# EAGLE design POWER_SUPPLY_BOARD (EAGLE 9.6.2)
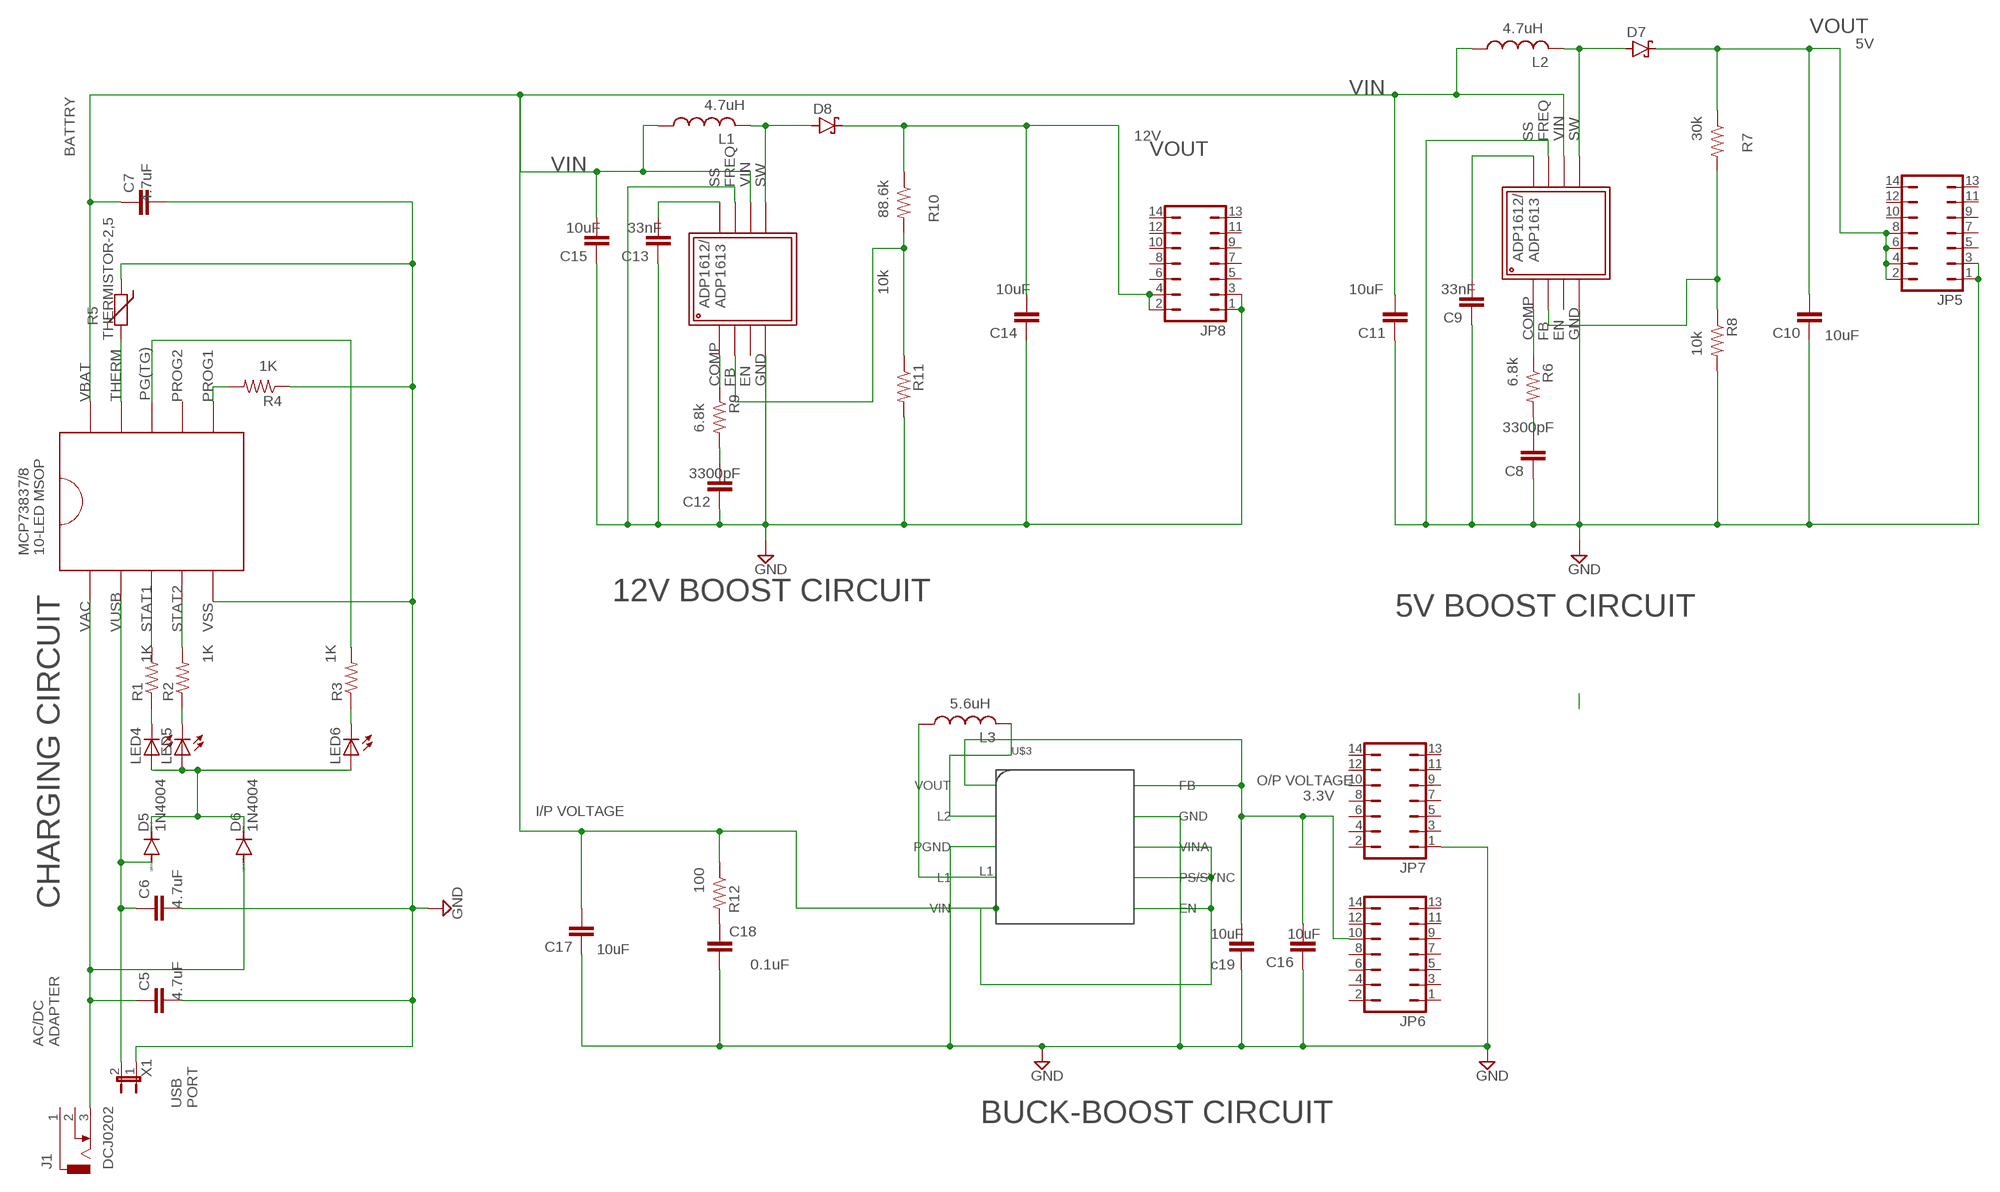
[diagram p0: schematic, sheet 1]

## Parts
C1  C2,5-3  [C2.5-3]
C5  C2.5/5  [C2.5-5]
C6  C2.5/5  [C2.5-5]
C7  C2.5/5  [C2.5-5]
C8  C2,5-3  [C2.5-3]
C9  C2,5-3  [C2.5-3]
C10  C2,5-3  [C2.5-3]
C11  C2,5-3  [C2.5-3]
C12  C2,5-3  [C2.5-3]
C13  C2,5-3  [C2.5-3]
C14  C2,5-3  [C2.5-3]
C15  C2,5-3  [C2.5-3]
C16  C2,5-3  [C2.5-3]
C17  C2,5-3  [C2.5-3]
C18  C2,5-3  [C2.5-3]
D5  1N4004  [DO41-10]
D6  1N4004  [DO41-10]
D7  SCHOTTKY-DIODEC4111-15  [C4111-15]
D8  SCHOTTKY-DIODEC4111-15  [C4111-15]
J1  DCJ0202  [DCJ0202]
JP1  JP1E  [JP1]
JP5  JP7Q  [JP7Q]
JP6  JP7Q  [JP7Q]
JP7  JP7Q  [JP7Q]
JP8  JP7Q  [JP7Q]
L1  L-US0204/5  [0204/5]
L2  L-US0204/5  [0204/5]
L3  L-US0204/5  [0204/5]
LED4  LED3MM  [LED3MM]
LED5  LED3MM  [LED3MM]
LED6  LED3MM  [LED3MM]
R1  R-US_0204/2V  [0204V]
R2  R-US_0204/2V  [0204V]
R3  R-US_0204/2V  [0204V]
R4  R-US_0204/2V  [0204V]
R5  THERMISTOR-2,5  [RS-2,5]
R6  R-US_0204/2V  [0204V]
R7  R-US_0204/2V  [0204V]
R8  R-US_0204/2V  [0204V]
R9  R-US_0204/2V  [0204V]
R10  R-US_0204/2V  [0204V]
R11  R-US_0204/2V  [0204V]
R12  R-US_0204/2V  [0204V]
U$1  ADP1612  [ADP1612]
U$2  ADP1612  [ADP1612]
U$3  TPS63002  [TPS63002]
U$4  MCP73837/8  [MCP73837/8]

## Nets
GND: C1.1 C5.2 C6.2 C7.2 C8.1 C9.1 C10.1 C11.1 C12.1 C13.1 C14.1 C15.1 C16.1 C17.1 C18.2 JP1.1 JP5.1 JP5.3 JP7.1 JP8.1 JP8.3 R4.1 R5.1 R8.2 R11.2 U$1.P$4 U$1.P$6 U$2.P$4 U$2.P$6 U$3.GND U$3.PGND U$4.P$5
N$1: C10.2 D7.C JP5.2 JP5.4 JP5.6 JP5.8 R7.1
N$2: L3.1 U$3.L1
N$3: C7.1 C11.2 C15.2 C17.2 L1.1 L2.1 R12.1 U$1.P$7 U$2.P$7 U$3.EN U$3.PS/SYNC U$3.VIN U$3.VINA U$4.P$10
N$4: C1.2 C16.2 JP6.10 U$3.FB U$3.VOUT
N$5: L3.2 U$3.L2
N$6: C18.1 R12.2
N$7: C5.1 D6.A J1.3 U$4.P$1
N$9: C14.2 D8.C JP8.2 JP8.4 R10.1
N$11: C6.1 D5.A JP1.2 U$4.P$2
N$12: D5.C D6.C LED4.A LED5.A LED6.A
N$13: R4.2 U$4.P$6
N$14: R5.2 U$4.P$9
N$15: LED4.K(C) R1.1
N$16: R1.2 U$4.P$3
N$17: R2.2 U$4.P$4
N$18: LED5.K(C) R2.1
N$19: LED6.K(C) R3.1
N$20: R3.2 U$4.P$8
N$24: D7.A L2.2 U$1.P$8
N$25: R6.1 U$1.P$1
N$26: C8.2 R6.2
N$27: R7.2 R8.1 U$1.P$2
N$28: C9.2 U$1.P$5
N$30: D8.A L1.2 U$2.P$8
N$32: R9.1 U$2.P$1
N$33: C12.2 R9.2
N$34: R10.2 R11.1 U$2.P$2
N$35: C13.2 U$2.P$5
Unconnected: J1.1 J1.2 JP5.5 JP5.7 JP5.9 JP5.10 JP5.11 JP5.12 JP5.13 JP5.14 JP6.1 JP6.2 JP6.3 JP6.4 JP6.5 JP6.6 JP6.7 JP6.8 JP6.9 JP6.11 JP6.12 JP6.13 JP6.14 JP7.2 JP7.3 JP7.4 JP7.5 JP7.6 JP7.7 JP7.8 JP7.9 JP7.10 JP7.11 JP7.12 JP7.13 JP7.14 JP8.5 JP8.6 JP8.7 JP8.8 JP8.9 JP8.10 JP8.11 JP8.12 JP8.13 JP8.14 U$1.P$3 U$2.P$3 U$4.P$7

## Notes on the sheet
- 4.7uH | VOUT
- 5V
- VIN
- 4.7uH
- 12V | 30k
- BATTRY | VOUT
- VIN
- 4.7uF
- 88.6k
- 10uF | 33nF
- 10k | 10uF | 10uF | 33nF
- 10uF
- 10k
- 1K
- 6.8k
- 6.8k | 3300pF
- 3300pF
- 12V BOOST CIRCUIT
- 5V BOOST CIRCUIT
- 1K | 1K | 1K
- 5.6uH
- O/P VOLTAGE
- 3.3V
- I/P VOLTAGE
- 100
- CHARGING CIRCUIT | 4.7uF
- 10uF | 10uF
- 10uF
- 0.1uF | c19
- 4.7uF
- AC/DC
  ADAPTER
- X1
- USB
  PORT
- BUCK-BOOST CIRCUIT

## Library data of the parts
C1 C5-C18 = capacitor-wima:C: CAPACITOR naming: grid - package width
D5 D6 = diode:1N4004: DIODE general purpose rectifier, 1 A
D7 D8 = diode:SCHOTTKY-DIODE: Schottky Diode
J1 = con-jack:DCJ0202: DC POWER JACK Source: DCJ0202.pdf; OC_FARNELL: unknown; OC_NEWARK: unknown
JP1 = jumper:JP1E: JUMPER
JP5-JP8 = jumper:JP7Q: JUMPER
L1-L3 = rcl:L-US: INDUCTOR, American symbol; SPICEPREFIX: L
LED4-LED6 = adafruit:LED: LED OSRAM: - CHIPLED LG R971, LG N971, LY N971, LG Q971, LY Q971, LO R971, LY R971 LH N974, LH R974 LS Q976, LO Q976, LY Q976 LO Q996 - Hyper CHIPLED LW Q18S LB Q993, LB Q99A, LB R99A - SideLED LS A670, LO A670, LY A670, LG A670, LP A670 LB A673, LV A673, LT A673, LW A673 LH A674 LY A675 LS A676, LA A676, LO A676, LY A676, LW A676 LS A679, LY A679, LG A679 - Hyper Micro SIDELED® LS Y876, LA Y876, LO Y876, LY Y876 LT Y87S - SmartLED LW L88C, LW L88S LB L89C, LB L89S, LG L890 LS L89K, LO L89K, LY L89K LS L896, LA L896, LO L896, LY L896 - TOPLED LS T670, LO T670, LY T670, LG T670, LP T670 LSG T670, LSP T670, LSY T670, LOP T670, LYG T670 LG T671, LOG T671, LSG T671 LB T673, LV T673, LT T673, LW T673 LH T674 LS T676, LA T676, LO T676, LY T676, LB T676, LH T676, LSB T676, LW T676 LB T67C, LV T67C, LT T67C, LS T67K, LO T67K, LY T67K, LW E67C LS E67B, LA E67B, LO E67B, LY E67B, LB E67C, LV E67C, LT E67C LW T67C LS T679, LY T679, LG T679 LS T770, LO T770, LY T770, LG T770, LP T770 LB T773, LV T773, LT T773, LW T773 LH T774 LS E675, LA E675, LY E675, LS T675 LS T776, LA T776, LO T776, LY T776, LB T776 LHGB T686 LT T68C, LB T68C - Hyper Mini TOPLED® LB M676 - Mini TOPLED Santana® LG M470 LS M47K, LO M47K, LY M47K Source: http://www.osram.convergy.de/
R1-R4 R6-R12 = rcl:R-US_: RESISTOR, American symbol; SPICEPREFIX: R
R5 = varistor:THERMISTOR: THERMISTOR
U$1 U$2 = ADP1612:ADP1612
U$3 = TPS63002:TPS63002
U$4 = MCP73837:MCP73837/8

## Board
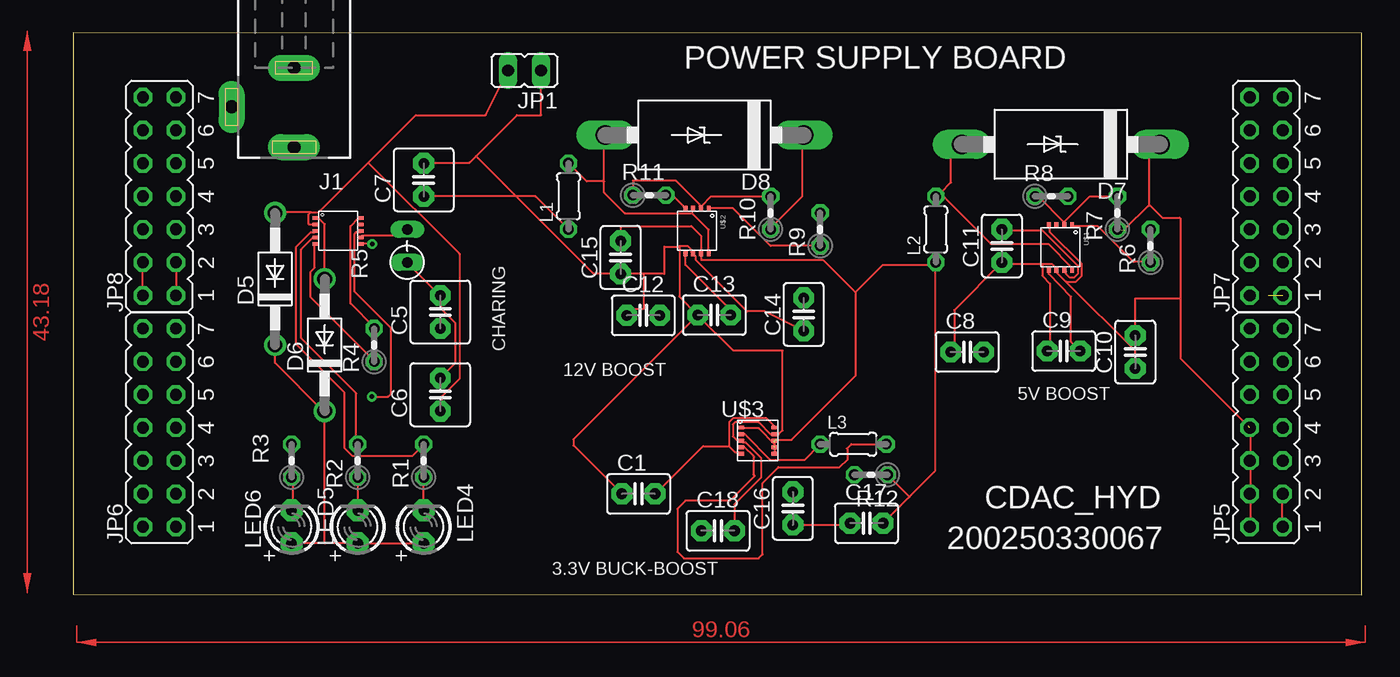
[diagram p1: board, top side]
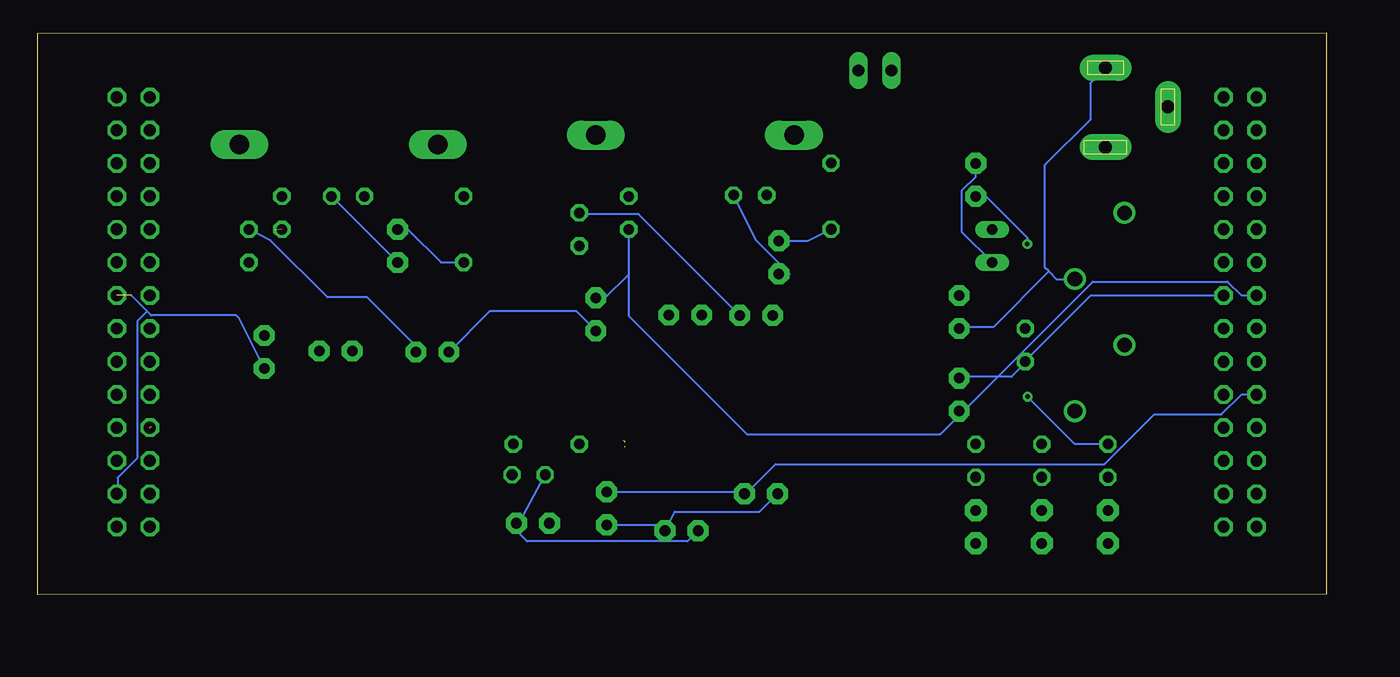
[diagram p2: board, bottom side, seen from below]

Size 99.06 x 43.22 mm. Coordinates in mm from the lower left corner, seen from the top.
Outline: 0,0.05 99.06,0 99.06,43.17 0,43.22 0,0.05
Copper layers (1*16): Top 0.035mm / dielectric 1.5mm / Bottom 0.035mm
Design rules "default": minimum track width 6mil, minimum drill 0.35mm, track to track 6mil, track to pad 6mil, pad to pad 6mil, via to via 6mil, smd to smd 6mil, copper to edge 40mil, drill to drill 6mil, minimum pad ring 10mil, minimum via ring 8mil, stop-mask expansion 4mil, vias tented up to drill 0mil, thermal gap 10mil

### Footprints (pad centres in the part's own frame; a part is rotated, then mirrored left to right if it is on the bottom)
C2.5-3 = drill 0.813 pad 1.6 octagon: 1 -1.27,0; 2 1.27,0
C2.5-5 = drill 0.813 pad 1.6 octagon: 1 -1.27,0; 2 1.27,0
DO41-10 = drill 1.118: A 5.08,0; C -5.08,0
C4111-15 = drill 1.499 long: A 7.62,0; C -7.62,0
DCJ0202 = drill 1 pad 2 long: 1 0,3.1; 2 4.8,0; 3 0,-3
JP1 = drill 0.914 long: 1 0,-1.27; 2 0,1.27
JP7Q = drill 0.914 octagon: 1 -7.62,-1.27; 2 -7.62,1.27; 3 -5.08,-1.27; 4 -5.08,1.27; 5 -2.54,-1.27; 6 -2.54,1.27; 7 0,-1.27; 8 0,1.27; 9 2.54,-1.27; 10 2.54,1.27; 11 5.08,-1.27; 12 5.08,1.27; 13 7.62,-1.27; 14 7.62,1.27
0204/5 = drill 0.813 octagon: 1 -2.54,0; 2 2.54,0
LED3MM = drill 0.813 pad 1.676 octagon: A -1.27,0; K 1.27,0
0204V = drill 0.813 octagon: 1 -1.27,0; 2 1.27,0
RS-2,5 = drill 0.813 long: 1 -1.27,0; 2 1.27,0
ADP1612 = smd 0.4 x 0.3: P$1 -9.25,5.4; P$2 -9.25,4.8; P$3 -9.25,4.2; P$4 -9.25,3.6; P$5 -5.75,3.6; P$6 -5.75,4.2; P$7 -5.75,4.8; P$8 -5.75,5.4
TPS63002 = smd 0.5 x 0.3: EN 2.85,0.55; FB 2.85,2.55; GND 2.85,2.05; L1 0.25,2.05; L2 0.25,1.05; PGND 0.25,1.55; PS/SYNC 2.85,1.05; VIN 0.25,2.55; VINA 2.85,1.55; VOUT 0.25,0.55
MCP73837/8 = smd 0.4 x 0.25: P$1 -3.25,8.5; P$2 -3.25,8; P$3 -3.25,7.5; P$4 -3.25,7; P$5 -3.25,6.5; P$6 0.25,8.5; P$7 0.25,8; P$8 0.25,7.5; P$9 0.25,7; P$10 0.25,6.5

### Placement (x,y rotation side)
C1  43.45,7.77 0 top
C5  28.21,21.74 90 top
C6  28.21,15.39 90 top
C7  26.95,31.9 90 top
C8  68.72,18.67 0 top
C9  76.15,18.74 0 top
C10  81.65,18.67 90 top
C11  71.4,26.82 90 top
C12  43.83,21.49 0 top
C13  49.28,21.51 0 top
C14  56.16,21.56 90 top
C15  42.08,25.94 90 top
C16  55.32,6.65 90 top
C17  60.99,5.5 0 top
C18  49.56,4.93 0 top
D5  15.52,24.28 90 top
D6  19.32,19.2 90 top
D7  75.93,34.63 180 top
D8  48.53,35.33 180 top
J1  16.98,37.51 180 top
JP1  34.69,40.31 90 top
JP5  91.72,12.85 90 top
JP6  6.62,12.85 90 top
JP7  91.72,30.63 90 top
JP8  6.62,30.63 90 top
L1  38.07,30.64 90 top
L2  66.31,28.09 90 top
L3  59.97,11.58 0 top
LED4  26.95,5.23 90 top
LED5  21.86,5.23 90 top
LED6  16.79,5.23 90 top
R1  26.95,10.31 90 top
R2  21.86,10.31 90 top
R3  16.79,10.31 90 top
R4  23.14,19.2 90 top
R5  25.68,26.82 90 top
R6  82.83,26.82 90 top
R7  80.28,29.36 90 top
R8  75.2,30.63 0 top
R9  57.42,28.09 90 top
R10  53.61,29.36 90 top
R11  44.29,30.72 0 top
R12  61.33,9.23 180 top
U$1  71.4,19.2 270 top
U$2  43.45,20.47 270 top
U$3  51.08,10.31 0 top
U$4  21.86,20.47 0 top

### Tracks (layer width: path | path; a pad name or v marks a point on that pad's centre or on a via)
GND  (1 unrouted)
  Top 0.152: 74.49,25.45 71.45,25.45 C11.1 67.73,21.88 67.73,18.8 C8.1 | 74.49,25.45 75.26,25.45 75.56,25.14 75.56,24.99 U$1.P$6 75.56,24.84 76.32,24.08 | 76.32,24.08 77.09,24.08 77.54,24.53 77.54,25.45 75.1,27.89 75.1,28.34 U$1.P$4 | 74.49,25.45 74.49,24.53 75.1,23.92 75.1,18.85 C9.1 | JP5.1 92.93,5.33 92.93,7.77 JP5.3 | C10.1 81.65,18.75 76.32,24.08 | 30.95,33.72 30.45,33.22 26.95,33.22 C7.2 | 30.95,33.72 34.11,36.88 35.97,36.88 JP1.1 | R5.1 25.73,25.45 28.16,23.01 C5.2 28.32,23.01 28.32,21.94 29.38,20.88 29.38,17.83 C6.2 | JP8.3 JP8.1 | U$4.P$5 18.56,26.97 18.56,25.14 18.26,24.84 18.26,22.86 23.14,17.98 R4.1 | R11.2 45.56,31.07 45.69,30.93 45.84,30.93 46.91,29.87 U$2.P$4 | 47.52,26.36 47.52,26.51 47.21,26.82 46.61,26.82 46.61,26.77 | 46.61,26.77 45.43,26.77 45.43,24.67 43.83,24.67 | 47.52,26.36 U$2.P$6 | 43.83,24.67 43.83,21.96 43.03,21.96 C12.1 | 43.83,24.67 C15.1 40.01,24.67 30.95,33.72 | 46.61,26.77 46.61,22.92 C13.1 | C14.1 53.15,21.79 51.8,21.79 47.88,25.72 47.88,26 47.52,26.36 | C13.1 50.75,18.77 54.53,18.77 54.53,12.65 54.22,12.34 54.07,12.34 U$3.GND 53.92,12.34 53.61,12.34 52.7,13.26 50.87,13.26 50.72,13.1 50.72,12.19 51.02,11.89 51.18,11.89 U$3.PGND | C16.1 55.32,5.33 59.55,5.33 C17.1 | 51.53,11.89 51.33,11.89 U$3.PGND | C1.1 38.46,11.5 38.46,11.96 C13.1 | U$3.PGND 51.45,11.74 51.67,11.74 52.86,10.54 52.86,8.98 50.83,6.96 C18.2
  Bottom 0.152: C11.1 R8.2 | 90.65,21.79 90.34,21.49 83.79,21.49 83.6,21.3 C10.1 | 90.65,21.79 91.87,23.01 | 90.65,21.79 91.41,21.03 91.41,10.51 92.93,8.99 92.93,7.77 JP5.3 | C6.2 28.16,16.76 24.2,16.76 23.14,17.83 R4.1 23.14,17.98 18.11,23.01 JP8.1 | C7.2 26.95,32.15 28.01,31.09 28.01,27.89 R5.1 | R11.2 43.81,27.23 41.25,24.67 C15.1 | 42.2,7.77 43.57,6.4 50.1,6.4 C18.2 51.24,5.33 55.32,5.33 C16.1 | C8.1 64.32,21.79 57.66,21.79 C14.1
N$1  (2 unrouted)
  Top 0.152: 90.5,7.77 90.5,5.33 JP5.2 | JP5.8 90.5,12.8 90.5,10.36 JP5.6 90.5,10.21 90.5,7.77 | 90.5,7.77 JP5.4 | 80.88,28.04 80.85,28.04 | 82.72,29.88 82.72,29.99 | 82.72,29.99 82.72,33.8 D7.C | 90.34,12.95 85.12,18.18 85.12,22.79 | 81.65,20.69 C10.2 81.65,22.77 81.67,22.79 85.12,22.79 | 85.12,22.79 85.12,28.93 85.06,28.99 83.72,28.99 82.72,29.99 | R7.1 80.83,28.09 82.72,29.99
N$2
  Top 0.152: L3.1 56.21,10.36 53.61,10.36 51.63,12.34 51.33,12.34 U$3.L1
N$3  (via drill 0.35)  (3 unrouted)
  Top 0.152: v22.98,26.97 22.22,26.97 U$4.P$10 | 48.28,25.75 48.28,26.21 U$2.P$7 | C15.2 42.08,28.33 47.53,28.33 48.27,27.59 48.27,25.75 48.28,25.75 | C7.1 35.54,30.63 L1.1 | R12.1 64.29,7.54 C17.2 66.26,9.51 66.26,25.45 L2.1 66.1,25.33 62.22,25.33 60.14,23.26 | U$1.P$7 76.32,24.84 76.32,24.69 76.63,24.38 76.93,24.38 77.24,24.69 77.24,25.3 74.49,28.04 71.45,28.04 C11.2 | 53.92,11.43 53.92,11.58 | 53.92,11.58 53.92,11.73 | 53.92,11.58 52.7,12.8 51.33,12.8 U$3.VIN | 55.24,11.89 55.17,11.89 | 55.17,11.89 54.07,11.89 | U$3.EN 53.92,10.97 53.92,11.27 U$3.PS/SYNC | 60.14,23.26 57.65,25.75 48.28,25.75 | 60.14,23.26 60.14,16.86 55.17,11.89 | 55.17,11.89
  Bottom 0.152: v22.98,26.97 22.98,27.43 26.18,30.63 C7.1 | C15.2 39.85,27.21 L1.1 | C11.2 71.29,28.04 70.56,28.04 68.07,25.55 L2.1
N$4
  Top 0.152: 50.42,11.43 50.87,10.97 51.18,10.97 U$3.VOUT | 50.42,11.43 50.42,13.26 50.72,13.56 53.31,13.56 53.92,12.95 U$3.FB | 50.42,11.43 48.43,11.43 44.78,7.77 C1.2
  Bottom 0.152: C16.2 44.88,7.92 C1.2 44.62,7.77 42.34,10.06 17.04,10.06 13.23,13.87 8.05,13.87 6.56,15.35 6.52,15.39 JP6.10
N$5
  Top 0.152: 52.35,10.61 52.28,10.68 | 52.28,10.68 51.6,11.36 U$3.L2 | 52.28,10.68 52.28,9.24 52.39,9.14 50.49,7.23 47.06,7.23 46.44,6.61 46.44,3.31 46.94,2.81 52.69,2.81 52.99,3.11 52.99,8.59 54.22,9.81 58.92,9.81 59.54,10.43 59.54,11.16 59.47,11.23 59.81,11.58 L3.2
N$6
  Bottom 0.152: R12.2 62.33,5 61.45,4.11 49.11,4.11 C18.1
N$7
  Top 0.152: D6.A 19.32,28.5 18.87,28.95 18.71,28.95 U$4.P$1
  Bottom 0.152: 21.32,24.85 25.6,20.57 28.16,20.57 C5.1 | D6.A 19.32,24.23 20.7,24.23 21.32,24.85 | J1.3 18.15,39.33 18.15,36.53 21.61,33.07 21.61,25.14 21.32,24.85
N$9
  Top 0.152: JP8.2 5.3,23.01 5.3,25.45 JP8.4 | D8.C 56.05,35.23 56.05,30.63 53.61,28.19 R10.1
  Bottom 0.152: R10.1 53.61,21.43 44.54,12.35 29.68,12.35 17.95,24.08 7.59,24.08 6.52,23.01 JP8.2 | C14.2 55.43,22.83 53.65,24.61
N$11
  Top 0.152: 18.26,29.41 15.57,29.41 D5.A | U$4.P$2 18.56,28.5 18.11,28.5 18.11,29.26 18.26,29.41 | 22.68,33.22 18.87,29.41 18.26,29.41 | 22.68,33.22 26.34,36.88 31.71,36.88 JP1.2 | 22.68,33.22 29.69,26.21 29.69,16.61 28.32,15.24 28.32,14.17 C6.1
N$12
  Top 0.152: D5.C 15.52,17.83 19.23,14.12 D6.C 19.32,3.96 | 19.32,3.96 LED5.A LED4.A | 19.32,3.96 LED6.A
N$13
  Top 0.152: U$4.P$6 22.07,28.95 21.92,28.95 21.31,28.34 21.31,22.4 23.14,20.57 R4.2
N$14
  Top 0.152: U$4.P$9 22.22,27.58 25.12,27.58 25.57,28.04 R5.2
N$15
  Top 0.152: LED4.K R1.1
N$16
  Top 0.152: R1.2 26.03,10.67 21.46,10.67 20.85,11.27 20.85,15.55 17.12,19.27 17.12,26.75 18.26,27.89 18.56,27.89 U$4.P$3
N$17
  Top 0.152: U$4.P$4 18.56,27.43 18.41,27.43 17.53,26.55 17.53,19.72 21.76,15.49 21.76,11.58 R2.2
N$18
  Top 0.152: R2.1 21.92,8.99 21.92,6.55 LED5.K
N$19
  Top 0.152: R3.1 16.89,8.99 16.89,6.55 LED6.K
N$20  (via drill 0.35)
  Top 0.152: v22.96,15.23 24.19,15.23 24.42,15.47 24.42,20.5 21.61,23.32 21.61,27.73 21.76,27.89 22.07,27.89 U$4.P$8
  Bottom 0.152: v22.96,15.23 19.31,11.58 R3.2
N$24
  Top 0.152: 66.65,30.87 70.55,26.97 74.95,26.97 76.78,25.14 76.78,24.99 U$1.P$8 | 66.65,30.87 66.42,30.63 L2.2 | 66.65,30.87 67.48,31.7 67.48,33.8 D7.A
N$25
  Top 0.152: U$1.P$1 76.93,28.34 78.76,28.34 81.5,25.6 82.72,25.6 R6.1
N$26
  Bottom 0.152: R6.2 81.19,27.27 76.77,22.86 73.73,22.86 69.99,19.12 C8.2
N$27
  Top 0.152: 76.17,28.65 76.17,28.5 U$1.P$2 76.17,28.65 | 76.17,28.65 74.19,30.63 R8.1 | R7.2 78.15,30.63 76.17,28.65
N$28
  Top 0.152: C9.2 76.7,19.46 76.7,22.92 75,24.67 U$1.P$5
N$30
  Top 0.152: U$2.P$8 48.86,28.07 47.59,29.34 42.39,29.34 40.81,30.91 40.81,31.78 | 40.81,31.78 40.81,35.23 D8.A | 40.81,31.78 39.47,31.78 L1.2
N$32
  Top 0.152: R9.1 53.61,26.82 50.72,29.72 48.89,29.72 U$2.P$1
N$33
  Bottom 0.152: C12.2 52.87,29.26 57.42,29.26 R9.2
N$34
  Top 0.152: R11.1 43.02,31.85 46.3,31.85 48.13,30.02 48.13,29.87 U$2.P$2 48.28,29.87 49.04,30.63 R10.2
N$35
  Top 0.152: C13.2 50.55,21.88 47.06,25.37 U$2.P$5
(copper drawn outside any net)
  shapes: Top area x3

### Text on the board
tNames: POWER SUPPLY BOARD | CHARING | 12V BOOST | 5V BOOST | CDAC_HYD | 200250330067 | 3.3V BUCK-BOOST